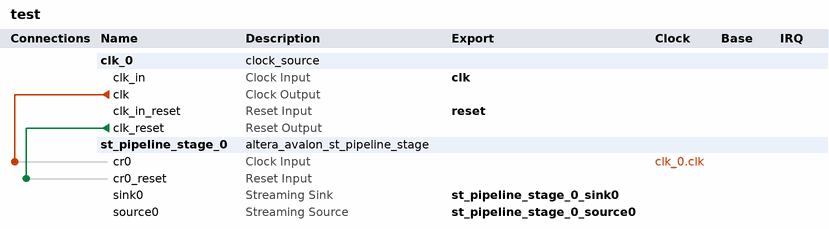
[diagram p0: system contents]
# Platform Designer (Qsys) system test, Cyclone V 5CSEMA5F31C6
# Parameters at their usual value, and those the tool derives, are not listed.
package require -exact qsys 16.1
create_system test
set_project_property DEVICE_FAMILY {Cyclone V}
set_project_property DEVICE 5CSEMA5F31C6

add_instance clk_0 clock_source 16.1
set_instance_parameter_value clk_0 clockFrequency 50000000

add_instance st_pipeline_stage_0 altera_avalon_st_pipeline_stage 16.1
set_instance_parameter_value st_pipeline_stage_0 BITS_PER_SYMBOL 8
set_instance_parameter_value st_pipeline_stage_0 CHANNEL_WIDTH 0
set_instance_parameter_value st_pipeline_stage_0 ERROR_WIDTH 0
set_instance_parameter_value st_pipeline_stage_0 MAX_CHANNEL 0
set_instance_parameter_value st_pipeline_stage_0 PIPELINE_READY 1
set_instance_parameter_value st_pipeline_stage_0 SYMBOLS_PER_BEAT 4
set_instance_parameter_value st_pipeline_stage_0 USE_EMPTY 0
set_instance_parameter_value st_pipeline_stage_0 USE_PACKETS 1

# connections
add_connection clk_0.clk st_pipeline_stage_0.cr0 clock
add_connection clk_0.clk_reset st_pipeline_stage_0.cr0_reset reset

# exported interfaces
add_interface clk clock sink
set_interface_property clk EXPORT_OF clk_0.clk_in
add_interface reset reset sink
set_interface_property reset EXPORT_OF clk_0.clk_in_reset
add_interface st_pipeline_stage_0_sink0 avalon_streaming sink
set_interface_property st_pipeline_stage_0_sink0 EXPORT_OF st_pipeline_stage_0.sink0
add_interface st_pipeline_stage_0_source0 avalon_streaming source
set_interface_property st_pipeline_stage_0_source0 EXPORT_OF st_pipeline_stage_0.source0

set_interconnect_requirement {$system} qsys_mm.clockCrossingAdapter HANDSHAKE
set_interconnect_requirement {$system} qsys_mm.enableEccProtection FALSE
set_interconnect_requirement {$system} qsys_mm.insertDefaultSlave FALSE
set_interconnect_requirement {$system} qsys_mm.maxAdditionalLatency 1

save_system test.qsys
